# Altium schematic sheet TAG.SchDoc
size A
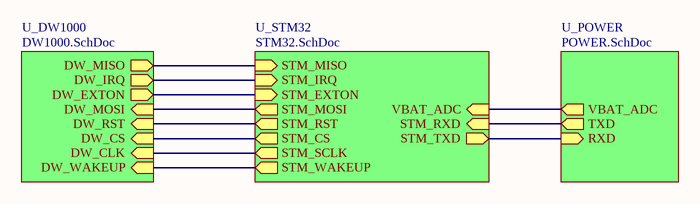
[diagram p0: TAG.SchDoc]

## Sub-sheets
U_DW1000 = DW1000.SchDoc: DW_MOSI (in), DW_CS (in), DW_EXTON (out), DW_IRQ (out), DW_RST (in), DW_CLK (in), DW_MISO (out), DW_WAKEUP (in)
U_POWER = POWER.SchDoc: VBAT_ADC (out), TXD (out), RXD (in)
U_STM32 = STM32.SchDoc: STM_CS (out), STM_SCLK (out), STM_MISO (in), STM_MOSI (out), STM_WAKEUP (out), STM_IRQ (in), STM_EXTON (in), STM_RST (out), STM_TXD (out), STM_RXD (in), VBAT_ADC (in)

## Nets
(unnamed): sheet U_DW1000/DW_MOSI, sheet U_STM32/STM_MOSI
(unnamed): sheet U_DW1000/DW_CS, sheet U_STM32/STM_CS
(unnamed): sheet U_DW1000/DW_EXTON, sheet U_STM32/STM_EXTON
(unnamed): sheet U_DW1000/DW_IRQ, sheet U_STM32/STM_IRQ
(unnamed): sheet U_DW1000/DW_RST, sheet U_STM32/STM_RST
(unnamed): sheet U_DW1000/DW_CLK, sheet U_STM32/STM_SCLK
(unnamed): sheet U_DW1000/DW_MISO, sheet U_STM32/STM_MISO
(unnamed): sheet U_DW1000/DW_WAKEUP, sheet U_STM32/STM_WAKEUP
(unnamed): sheet U_POWER/VBAT_ADC, sheet U_STM32/VBAT_ADC
(unnamed): sheet U_POWER/TXD, sheet U_STM32/STM_RXD
(unnamed): sheet U_POWER/RXD, sheet U_STM32/STM_TXD